# Altium schematic sheet QiCharger.SchDoc
size A4; Author: Nico ZEHETNER; CompanyName: HTBLVA Anichstraße; DrawnBy: Nico ZEHETNER; Engineer: Nico ZEHETNER; Organization: HTBLVA Anichstraße; Address1: WPF Embedded Systems; Address2: Anichstraße 26-28; Address3: A-6020 Innsbruck; Address4: Austria; DocumentNumber: 1; Revision: V0.1; SheetNumber: 1; SheetTotal: 1; PageSetup: Record=PageOptions|CenterHorizontal=True|CenterVertical=True|PrintScale=1.00|XCorrection=1.00|YCorrection=1.00|PrintKind=0|BorderSize=5000000|LeftOffset=0|BottomOffset=0|Orientation=2|PaperLength=1000|PaperWidth=1000|Scale=100|PaperSource=7|PrintQuality=-4|MediaType=1|DitherType=10|PaperKind=A4|PrintScaleMode=1; SPICEModelCacheQIFQSHGP: <root> / <DocumentId>QIFQSHGP</DocumentId> / <CacheFrame Number="0"> / <Model Name="led_red" Kind="MDL"> / <Text>*Typ RED GaAs LED: Vf=1.7V Vr=4V If=40mA trr=3uS / *LED Pinout: 1=A, 2=K / .MODEL LED_RED D (IS=93.2P RS=42M N=3.73 BV=4 IBV=10U / + CJO=2.97P VJ=.75 M=.333 TT=4.32U)</Text> / </Model> / </CacheFrame> / </root>
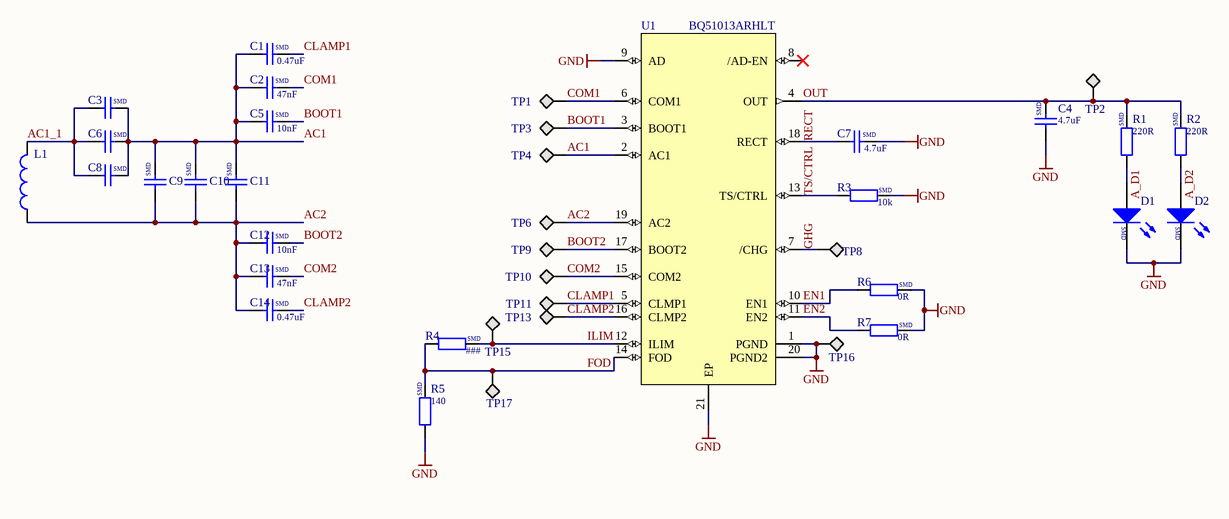
[diagram p0: QiCharger.SchDoc]

## Parts
C1  0.47uF  [C_SMD_C0402]
C2  47nF  [C_SMD_C0402]
C3  ###  [C_SMD_C0402]  (value not drawn)
C4  4.7uF  [C_SMD_C0402]
C5  10nF  [C_SMD_C0402]
C6  ###  [C_SMD_C0603]  (value not drawn)
C7  4.7uF  [C_SMD_C0402]
C8  ###  [C_SMD_C0805]  (value not drawn)
C9  ###  [C_SMD_C0805]  (value not drawn)
C10  ###  [C_SMD_C0603]  (value not drawn)
C11  ###  [C_SMD_C0402]  (value not drawn)
C12  10nF  [C_SMD_C0402]
C13  47nF  [C_SMD_C0402]
C14  0.47uF  [C_SMD_C0402]
D1  SMD LED RED  [SMD_0805_CHIP-LED]  (value not drawn)
D2  SMD LED RED  [SMD_0805_CHIP-LED]  (value not drawn)
L1  Trace Coil  [PCBComponent_1]  (value not drawn)
R1  220R  [R_SMD_R0402]
R2  220R  [R_SMD_R0402]
R3  10k  [R_SMD_R0402]
R4  ###  [R_SMD_R0402]
R5  140  [R_SMD_R0402]
R6  0R  [R_SMD_R0402]
R7  0R  [R_SMD_R0402]
TP1  TESTPOINT  [TP_1.25MM]  (value not drawn)  (no BOM)
TP2  TESTPOINT  [TP_1.25MM]  (value not drawn)  (no BOM)
TP3  TESTPOINT  [TP_1.25MM]  (value not drawn)  (no BOM)
TP4  TESTPOINT  [TP_1.25MM]  (value not drawn)  (no BOM)
TP6  TESTPOINT  [TP_1.25MM]  (value not drawn)  (no BOM)
TP8  TESTPOINT  [TP_1.25MM]  (value not drawn)  (no BOM)
TP9  TESTPOINT  [TP_1.25MM]  (value not drawn)  (no BOM)
TP10  TESTPOINT  [TP_1.25MM]  (value not drawn)  (no BOM)
TP11  TESTPOINT  [TP_1.25MM]  (value not drawn)  (no BOM)
TP13  TESTPOINT  [TP_1.25MM]  (value not drawn)  (no BOM)
TP15  TESTPOINT  [TP_1.25MM]  (value not drawn)  (no BOM)
TP16  TESTPOINT  [TP_1.25MM]  (value not drawn)  (no BOM)
TP17  TESTPOINT  [TP_1.25MM]  (value not drawn)  (no BOM)
U1  BQ51013ARHLT  [IC_MSP430FR2522IRHLR]

## Nets
GND: C4.1 C7.2 D1.K D2.K R3.2 R5.1 R6.2 R7.2 TP16.1 U1.1(PGND) U1.9(AD) U1.20(PGND2) U1.21(EP)
A_D1: D1.A R1.1
A_D2: D2.A R2.1
AC1: C1.1 C2.1 C3.2 C5.1 C6.2 C8.2 C9.2 C10.2 C11.2 TP4.1 U1.2(AC1)
AC1_1: C3.1 C6.1 C8.1 L1.1
AC2: C9.1 C10.1 C11.1 C12.1 C13.1 C14.1 L1.2 TP6.1 U1.19(AC2)
BOOT1: C5.2 TP3.1 U1.3(BOOT1)
BOOT2: C12.2 TP9.1 U1.17(BOOT2)
CLAMP1: C1.2 TP11.1 U1.5(CLMP1)
CLAMP2: C14.2 TP13.1 U1.16(CLMP2)
COM1: C2.2 TP1.1 U1.6(COM1)
COM2: C13.2 TP10.1 U1.15(COM2)
EN1: R6.1 U1.10(EN1)
EN2: R7.1 U1.11(EN2)
FOD: R4.1 R5.2 TP17.1 U1.14(FOD)
GHG: TP8.1 U1.7(/CHG)
ILIM: R4.2 TP15.1 U1.12(ILIM)
OUT: C4.2 R1.2 R2.2 TP2.1 U1.4(OUT)
RECT: C7.1 U1.18(RECT)
TS/CTRL: R3.1 U1.13(TS/CTRL)

Not connected (* = marked no-connect by the designer): U1 8(/AD-EN)*

## Notes on the sheet
- Title:
- Author:
- Approved:
- Size:
- Date:
- Git Hash:
- A4
- Prj:
- SW Version:
- Variant:
- Edited:
- CONFIDENTIAL
- File:
- (in symbol C_SMD) SMD
- (in symbol R_SMD) SMD
- (in symbol SMD_LED_RED) SMD

## Library data of the parts
C1-C14 = C_SMD: SMD Capacitor; Usage: only permitted for non-commercial purposes at HTL I Innsbruck; Rated Voltage: 25V; Published: 21-Feb-2011; LatestRevisionDate: 07-Sep-2019
  C1 C14: Value: 0.47uF
  C2 C13: Value: 47nF
  C3 C6 C8-C11: Value: ###
  C4 C7: Value: 4.7uF
  C5 C12: Value: 10nF
D1 D2 = SMD_LED_RED: Red GaAs LED (Vf=1.7V, If=40mA); Usage: only permitted for non-commercial purposes at HTL I Innsbruck; SimulationModellSource: Miscellaneous Devices; Published: 29-Mar-2017; LatestRevisionDate: 21-Jun-2015
L1 = Trace Coil: roughly 4uH; trace width of 0.4mm
R1-R7 = R_SMD: SMD Resistor; Usage: only permitted for non-commercial purposes at HTL I Innsbruck; Published: 21-Feb-2011; LatestRevisionDate: 07-Sep-2019
  R1 R2: Value: 220R
  R3: Value: 10k
  R4: Value: ###
  R5: Value: 140
  R6 R7: Value: 0R
TP1-TP4 TP6 TP8-TP11 TP13 TP15-TP17 = TP TEST POINT: Test Point; Usage: Only permitted in classes taught by Prof. Michael Kupfner, HTBLVA Anichstrasse; Published: 03-Aug-2024; Publisher: Michael Kupfner
U1 = BQ51013ARHLT: Integrated Wireless power Receiver Solution, Qi (Wireless power Consortium) Compliant 20-VQFN 0 to 125; MF: Texas Instruments; Check_prices: https://www.snapeda.com/parts/BQ51013ARHLT/Texas%20Instruments/view-part/134659/?ref=eda; Package: VQFN-20 Texas Instruments; Value: *; MP: BQ51013ARHLT; Price: None; Availability: Warning; SnapEDA_Link: https://www.snapeda.com/parts/BQ51013ARHLT/Texas%20Instruments/view-part/134659/?ref=snap; Purchase-URL: https://pricing.snapeda.com/search/part/BQ51013ARHLT/?ref=eda